# EAGLE design Trigger Delay Board (EAGLE 9.6.0)
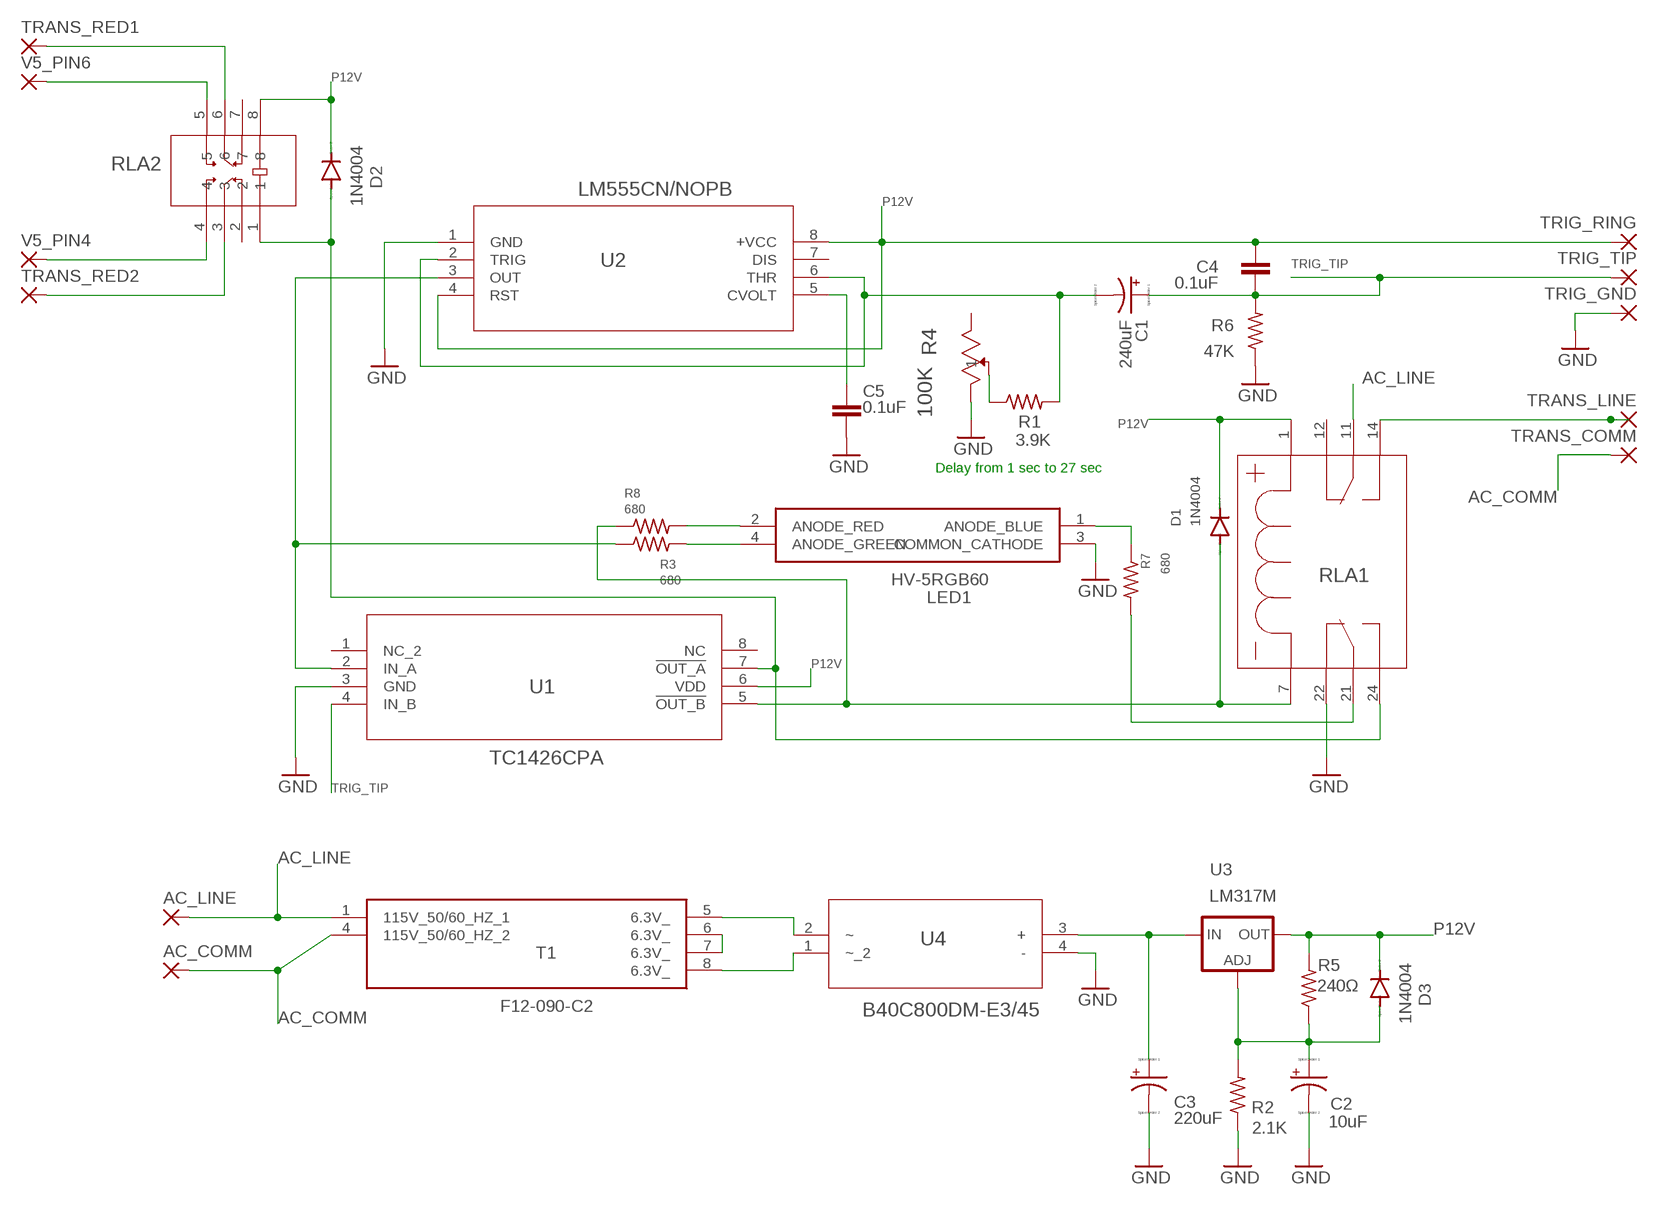
[diagram p0: schematic, sheet 1]

## Parts
AC_COMM  3,81/1,4  [3,81/1,4]
AC_LINE  3,81/1,4  [3,81/1,4]
C1  240uF  CPOL-USE1.8-4  [E1,8-4]
C2  10uF  CPOL-USE1.8-4  [E1,8-4]
C3  220uF  CPOL-USE1.8-4  [E1,8-4]
C4  0.1uF  C-EU025-024X044  [C025-024X044]
C5  0.1uF  C-EU025-024X044  [C025-024X044]
D1  1N4004  [DO41-10]
D2  1N4004  [DO41-10]
D3  1N4004  [DO41-10]
LED1  HV-5RGB60  [HV5RGB25]
R1  3.9K  R-US_0207/10  [0207/10]
R2  2.1K  R-US_0207/10  [0207/10]
R3  680  R-US_0207/10  [0207/10]
R4  100K  64WR100KLF  [RES3_64W]
R5  240Ω  R-US_0207/10  [0207/10]
R6  47K  R-US_0207/10  [0207/10]
R7  680  R-US_0207/10  [0207/10]
R8  680  R-US_0207/10  [0207/10]
RLA1  RTE24012  [RELAY-DPDT_5MM]
RLA2  G2RL-2_DC12  [RELAY_G2RL-2]
T1  F12-090-C2  [F12090C2]
TRANS_COMM  3,81/1,4  [3,81/1,4]
TRANS_LINE  3,81/1,4  [3,81/1,4]
TRANS_RED1  3,81/1,4  [3,81/1,4]
TRANS_RED2  3,81/1,4  [3,81/1,4]
TRIG_GND  3,81/1,4  [3,81/1,4]
TRIG_RING  3,81/1,4  [3,81/1,4]
TRIG_TIP  3,81/1,4  [3,81/1,4]
U1  TC1426CPA  [PDIP8_300MC]
U2  LM555CN/NOPB  [N08E]
U3  LM317MB  [TO220L1]
U4  B40C800DM-E3/45  [DIP4_DFM]
V5_PIN4  3,81/1,4  [3,81/1,4]
V5_PIN6  3,81/1,4  [3,81/1,4]

## Nets
AC_COMM [AC_PWR]: AC_COMM.1(P) T1.4(115V_50/60_HZ_2) TRANS_COMM.1(P)
AC_LINE [AC_PWR]: AC_LINE.1(P) RLA1.11 T1.1(115V_50/60_HZ_1)
GND: C2.- C3.- C5.2 LED1.3(COMMON_CATHODE) R2.1 R4.1 R6.1 RLA1.22 TRIG_GND.1(P) U1.3(GND) U2.1(GND) U4.4(-)
N$1: C2.+ D3.A R2.2 R5.1 U3.1(ADJ)
N$2: T1.6(6.3V_) T1.7(6.3V_)
N$3: T1.5(6.3V_) U4.2(~)
N$4: T1.8(6.3V_) U4.1(~_2)
N$5: D2.A RLA1.24 RLA2.1 U1.7(!OUT_A)
N$6: R3.1 U1.2(IN_A) U2.3(OUT)
N$8: LED1.2(ANODE_RED) R8.2
N$9: R1.1 R4.2
N$10: C5.1 U2.5(CVOLT)
N$11: D1.A R8.1 RLA1.7 U1.5(!OUT_B)
N$12: R7.2 RLA1.21
N$13: C1.- R1.2 U2.2(TRIG) U2.6(THR)
N$17: LED1.1(ANODE_BLUE) R7.1
N$18: LED1.4(ANODE_GREEN) R3.2
N$20: C3.+ U3.3(IN) U4.3(+)
P12V: C4.1 D1.C D2.C D3.C R5.2 RLA1.1 RLA2.8 TRIG_RING.1(P) U1.6(VDD) U2.4(RST) U2.8(+VCC) U3.2(OUT)
TRANS_LINE [AC_PWR]: RLA1.14 TRANS_LINE.1(P)
TRANS_RED1 [PLATE]: RLA2.6 TRANS_RED1.1(P)
TRANS_RED2 [PLATE]: RLA2.3 TRANS_RED2.1(P)
TRIG_TIP: C1.+ C4.2 R6.2 TRIG_TIP.1(P) U1.4(IN_B)
V5_PIN4 [PLATE]: RLA2.4 V5_PIN4.1(P)
V5_PIN6 [PLATE]: RLA2.5 V5_PIN6.1(P)
Unconnected: R4.3 RLA1.12 RLA2.2 RLA2.7 U1.1(NC_2) U1.8(NC) U2.7(DIS)

## Notes on the sheet
- Delay from 1 sec to 27 sec

## Library data of the parts
AC_COMM AC_LINE TRANS_COMM TRANS_LINE TRANS_RED1 TRANS_RED2 TRIG_GND TRIG_RING TRIG_TIP V5_PIN4 V5_PIN6 = wirepad:3,81/1,4: THROUGH-HOLE PAD
C1-C3 = resistor:CPOL-US: POLARIZED CAPACITOR, American symbol
C4 C5 = rcl:C-EU: CAPACITOR, European symbol; SPICEPREFIX: C
D1-D3 = diode:1N4004: DIODE general purpose rectifier, 1 A
LED1 = HV-5RGB60:HV-5RGB60: Standard LEDs - Through Hole RGB LED Source: Datasheet <http://www.inolux-corp.com/datasheet/Inolux Lamp/TH Lamp/HV-5RGBXX 5mm Full-Color Series.pdf>; DESCRIPTION: Standard LEDs - Through Hole RGB LED; HEIGHT: 8.9mm; MANUFACTURER_NAME: Inolux; MANUFACTURER_PART_NUMBER: HV-5RGB60; MOUSER_PART_NUMBER: 743-HV-5RGB60; MOUSER_PRICE-STOCK: https://www.mouser.com/Search/Refine.aspx?Keyword=743-HV-5RGB60
R1-R3 R5-R8 = resistor:R-US_: RESISTOR, American symbol
R4 = 64WR100KLF:64WR100KLF; COPYRIGHT: Copyright (C) 2016 Accelerated Designs. All rights reserved; MANUFACTURER_PART_NUMBER: 64WR100KLF; VENDOR: TT Electronics
RLA1 = RTE24012:RTE24012; BUILT_BY: EMA_UL_Team; COPYRIGHT: Copyright (C) 2016 Accelerated Designs. All rights reserved; MANUFACTURER_PART_NUMBER: RTE24012; VENDOR: TE Connectivity
RLA2 = G2RL-2_DC12:G2RL-2_DC12; BUILT_BY: EMA_Justin; COPYRIGHT: Copyright (C) 2018 Accelerated Designs. All rights reserved; MANUFACTURER_PART_NUMBER: G2RL-2 DC12; VENDOR: Omron
T1 = SamacSys_Parts:F12-090-C2: Power Transformers PC/1.1VA/6P/Class2/3 12.6VCT@0.09A Series Source: Datasheet <http://catalog.triadmagnetics.com/Asset/F12-090-C2.pdf>; ALLIED_NUMBER: 70314095; ALLIED_PRICE-STOCK: https://www.alliedelec.com/triadmagnetics-f12-090-c2/70314095/; DESCRIPTION: Power Transformers PC/1.1VA/6P/Class2/3 12.6VCT@0.09A Series; HEIGHT: 28.702mm; MANUFACTURER_NAME: Triad Magnetics; MANUFACTURER_PART_NUMBER: F12-090-C2; MOUSER_PART_NUMBER: 553-F12-090-C2; MOUSER_PRICE-STOCK: https://www.mouser.com/Search/Refine.aspx?Keyword=553-F12-090-C2
U1 = TC1426CPA:TC1426CPA: 1.2A Dual High-Speed MOSFET Drivers; BUILT_BY: EMA_UL_Team; MANUFACTURER_PART_NUMBER: TC1426CPA; VENDOR: Microchip
U2 = LM555CN:LM555CN/NOPB; MANUFACTURER_PART_NUMBER: LM555CN/NOPB; VENDOR: National
U3 = v-reg:LM317?*: 500 mA Adjustable Output Positive Voltage Regulator Source: http://www.onsemi.co.jp .. LM317M-D.PDF; PARTNUMBER: LM317M
U4 = B40C800DM-E3-45:B40C800DM-E3/45; BUILT_BY: EMA_UL_Team; MANUFACTURER_PART_NUMBER: B40C800DM-E3/45; SPICEPREFIX: E; VENDOR: Vishay

## Net classes
1 AC_PWR: width 0.813 mm, clearance 1.448 mm
2 PLATE: width 0.127 mm, clearance 2.032 mm

## Board
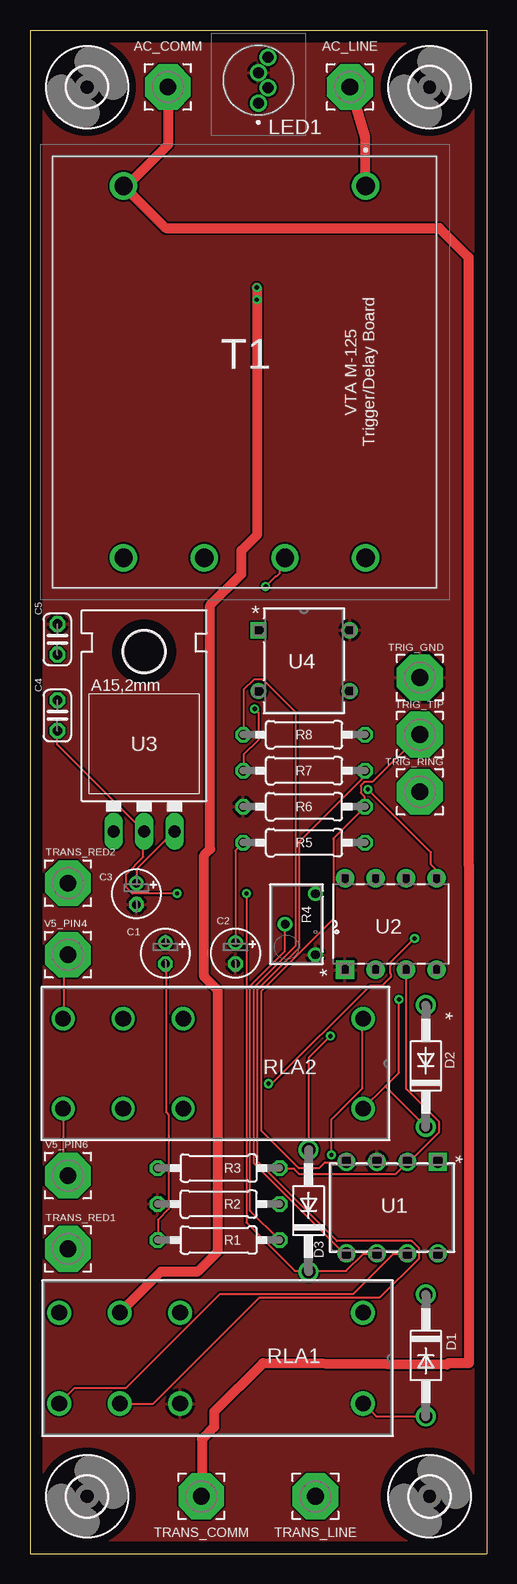
[diagram p1: board, top side]
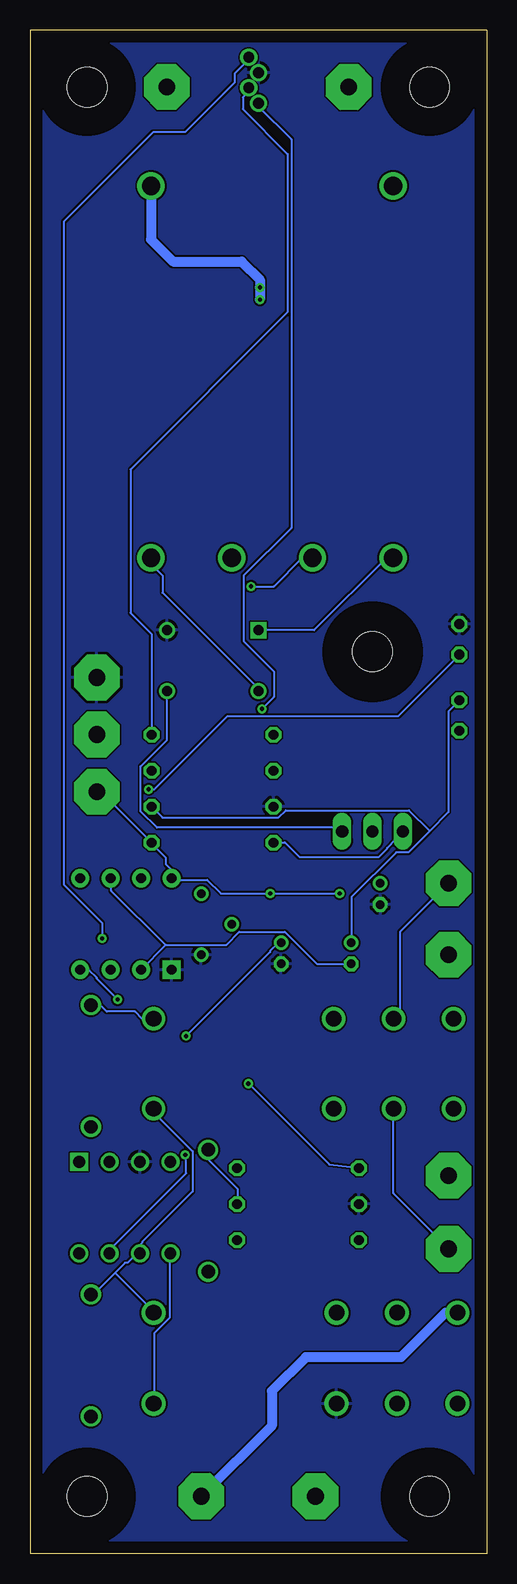
[diagram p2: board, bottom side, seen from below]

Size 38.1 x 127 mm. Coordinates in mm from the lower left corner, seen from the top.
Outline: 0,0 38.1,0 38.1,127 0,127 0,0
Copper layers (1*16): Top 0.035mm / dielectric 1.5mm / Bottom 0.035mm
Design rules "default": minimum track width 6mil, minimum drill 0.35mm, track to track 6mil, track to pad 6mil, pad to pad 6mil, via to via 6mil, smd to smd 6mil, copper to edge 40mil, drill to drill 6mil, minimum pad ring 10mil, minimum via ring 8mil, stop-mask expansion 4mil, vias tented up to drill 0mil, thermal gap 10mil

### Footprints (pad centres in the part's own frame; a part is rotated, then mirrored left to right if it is on the bottom)
3,81/1,4 = drill 1.397 pad 3.81 octagon: 1 0,0
E1,8-4 = drill 0.711 pad 1.168: + -0.889,0 | drill 0.711 pad 1.168 octagon: - 0.889,0
C025-024X044 = drill 0.813 octagon: 1 -1.27,0; 2 1.27,0
DO41-10 = drill 1.118: A 5.08,0; C -5.08,0
HV5RGB25 = drill 0.91 pad 1.35: 1 0,0; 2 1.27,-0.8; 3 2.54,0; 4 3.81,-0.8
0207/10 = drill 0.813 octagon: 1 -5.08,0; 2 5.08,0
RES3_64W = drill 0.711 pad 1.219: 1 -5.08,-3.175; 2 -2.54,-0.635; 3 0,-3.175
RELAY-DPDT_5MM = drill 1.295 pad 2.007: 1 -7.569,24.282; 7 0,24.282; 11 -7.569,3.988; 12 -7.569,9.017; 14 -7.569,-1.067; 21 0,3.988; 22 0,9.017; 24 0,-1.067
RELAY_G2RL-2 = drill 1.295 pad 1.803: 1 -7.493,24.613; 2 -7.493,9.601; 3 -7.493,4.597; 4 -7.493,-0.406; 5 0,-0.406; 6 0,4.597; 7 0,9.601; 8 0,24.613
F12090C2 = drill 1.524 pad 2.286: 1 0,0; 4 20.193,0; 5 0,31; 6 6.731,31; 7 13.462,31; 8 20.193,31
PDIP8_300MC = drill 0.991 pad 1.499 square: 1 -7.62,7.62 | drill 0.991 pad 1.499: 2 -7.62,5.08; 3 -7.62,2.54; 4 -7.62,0; 5 0,0; 6 0,2.54; 7 0,5.08; 8 0,7.62
N08E = drill 0.813 pad 1.524 square: 1 -7.62,7.62 | drill 0.813 pad 1.524: 2 -7.62,5.08; 3 -7.62,2.54; 4 -7.62,0; 5 0,0; 6 0,2.54; 7 0,5.08; 8 0,7.62
TO220L1 = drill 1.016 long: 1 -2.54,-3.81; 2 0,-3.81; 3 2.54,-3.81 | hole 3.302: 0,11.176
DIP4_DFM = drill 0.838 pad 1.346 square: 1 -7.62,5.08 | drill 0.838 pad 1.346: 2 -7.62,0; 3 0,0; 4 0,5.08
3,3 = hole 3.3: 0,0

### Placement (x,y rotation side)
AC_COMM  11.51,122.25 0 top
AC_LINE  26.69,122.25 0 top
C1  11.3,50.04 270 top
C2  17.14,50.04 270 top
C3  8.89,54.99 270 top
C4  2.29,69.85 90 top
C5  2.29,76.2 90 top
D1  33.02,16.51 270 top
D2  33.02,40.64 90 top
D3  23.24,28.57 90 top
LED1  19.05,120.9 90 top
R1  15.74,26.13 180 top
R2  15.74,29.13 0 top
R3  15.74,32.13 180 top
R4  20.64,54.99 90 top
R5  22.87,59.25 0 top
R6  22.87,62.25 0 top
R7  22.87,65.25 0 top
R8  22.87,68.25 0 top
RLA1  3.51,12.5 270 top
RLA2  3.17,37.08 270 top
T1  28,114 180 top
TRANS_COMM  14.29,4.76 0 top
TRANS_LINE  23.81,4.76 0 top
TRANS_RED1  3.17,25.4 0 top
TRANS_RED2  3.17,55.88 0 top
TRIG_GND  32.52,73.03 0 top
TRIG_RING  32.52,63.5 0 top
TRIG_TIP  32.52,68.26 0 top
U1  26.39,25.02 270 top
U2  33.91,56.29 90 top
U3  9.53,64.01 0 top
U4  26.67,71.88 0 top
U$1  [3,3]  4.76,4.76 0 top
U$2  [3,3]  33.34,4.76 0 top
U$7  [3,3]  4.76,122.24 0 top
U$8  [3,3]  33.34,122.24 0 top
V5_PIN4  3.17,49.91 0 top
V5_PIN6  3.17,31.5 0 top

### Tracks (layer width: path | path; a pad name or v marks a point on that pad's centre or on a via)
AC_COMM
  Top 0.813: T1.4 7.94,113.86 | 7.94,113.86 11.32,110.49 34.16,110.49 36.58,108.08 36.58,57.42 36.62,57.38 36.62,15.88 34.92,15.88 34.8,15.75 19.43,15.88 15.37,11.82 15.37,10.55 14.35,9.53 14.35,4.8 14.33,4.8 TRANS_COMM.1 | AC_COMM.1 11.51,117.43 7.94,113.86
AC_LINE  (via drill 0.35)
  Top 0.813: AC_LINE.1 27.94,118.06 27.94,114.07 27.96,114.07 T1.1 | v18.92,105.54 18.92,84.89 17.64,83.61 17.64,81.64 15.04,79.05 15.04,58.73 14.54,58.22 14.54,48.09 15.63,47 15.63,25.15 13.96,23.48 10.9,23.48 RLA1.11
  Bottom 0.813: T1.1 28,109.53 26.16,107.7 20.45,107.7 18.92,106.17 v18.92,105.54 v18.92,104.52
GND
  pour Top: -2,128 -2,-2 39,-2 39,128
  pour Bottom: -2,128 -2,-2 39,-2 39,129 -1,129
N$1  (via drill 0.35)
  Top 0.152: C2.+ 17.14,58.6 17.75,59.21 R5.1 | D3.A 23.24,41.3 v25.07,43.13
  Bottom 0.152: D3.A 23.24,32.84 20.8,30.4 20.8,29.18 R2.2 | U3.1 7.01,60.2 7.62,59.59 7.62,59.51 8.31,58.83 8.31,58.75 8.99,58.06 15.62,58.06 16.84,59.28 17.75,59.28 R5.1 | v25.07,43.13 18.06,50.14 18.06,50.22 17.37,50.9 17.14,50.9 C2.+
N$2  (via drill 0.35)
  Top 0.152: v19.66,80.62 20.5,81.46 20.57,81.46 20.8,81.69 20.8,82.53 21.26,82.98 T1.6
  Bottom 0.152: v19.66,80.62 17.75,80.62 15.39,82.98 14.55,82.98 T1.7
N$3
  Bottom 0.152: U4.2 19.05,72.08 27.05,80.09 27.05,81.53 27.96,82.45 27.96,82.98 T1.5
N$4
  Bottom 0.152: U4.1 14.4,76.96 8.38,82.98 7.85,82.98 T1.8
N$5  (via drill 0.35)
  Top 0.152: RLA1.24 3.73,13.79 8,13.79 15.85,21.64 26.98,21.64 30.33,24.99 31.47,24.99 U1.7 | v25.15,33.22 25.15,36.2 27.74,38.79 27.74,44.58 RLA2.1
  Bottom 0.152: D2.A 32.23,45.72 31.7,45.19 29.34,45.19 28.73,44.58 RLA2.1 | v25.15,33.22 25.15,33.07 25.07,32.99 25.07,31.7 31.47,25.3 U1.7
N$6
  Top 0.152: R3.1 20.88,32.08 22.02,32.08 22.48,31.62 30.48,31.62 31.47,32.61 U1.2 31.47,32.69 31.7,32.69 34.14,35.13 34.14,35.97 31.39,38.71 31.39,48.62 U2.3
N$8
  Bottom 0.152: R8.2 27.96,68.28 27.96,76.66 29.72,78.41 29.72,90.37 16.61,103.48 16.61,116.66 20.34,120.4 20.34,121.39 19.89,121.84 19.89,122.15 LED1.2
N$9
  Top 0.152: R4.2 21.26,52.43 21.26,50.22 18.36,47.32 18.36,28.57 20.8,26.14 R1.1
N$10  (via drill 0.35)
  Top 0.152: v28.19,63.7 33.45,58.45 33.45,57.45 33.91,57 U2.5
  Bottom 0.152: v28.19,63.7 27.74,63.7 21.64,69.8 7.39,69.8 2.29,74.91 C5.1
N$11
  Top 0.152: D1.A 28.88,11.43 27.81,12.5 RLA1.7 | R8.1 17.83,68.28 17.83,72.01 18.67,72.85 19.43,72.85 22.17,70.1 22.17,50.67 18.67,47.17 18.67,32.54 26.14,25.07 26.36,25.07 U1.5
  Bottom 0.152: RLA1.7 27.74,12.5 27.74,18.36 26.44,19.66 26.44,24.99 U1.5
N$12
  Top 0.152: RLA1.21 10.29,12.5 19.13,21.34 29.18,21.34 32.46,24.61 32.46,25.45 31.85,26.06 25.6,26.06 18.97,32.69 18.97,47.02 22.48,50.52 22.48,59.36 27.89,64.77 27.89,65.23 R7.2
N$13
  Top 0.152: R1.2 10.67,27.81 11.58,28.73 11.58,36.58 11.35,36.8 11.35,49.15 C1.-
  Bottom 0.152: C1.- 14.17,49.15 16.84,51.82 20.65,51.82 21.72,50.75 26.75,50.75 26.78,50.71 | U2.2 26.78,50.71 | 26.78,50.71 31.32,55.24 31.32,56.24 U2.6
N$17  (via drill 0.35)
  Top 0.152: v18.75,70.41 19.05,70.1 19.05,67.82 17.83,66.6 17.83,65.3 R7.1
  Bottom 0.152: v18.75,70.41 17.75,71.4 17.75,73.53 20.27,76.05 20.27,81.53 16.31,85.5 16.31,117.88 19.05,120.62 LED1.1
N$18  (via drill 0.35)
  Top 0.152: v19.89,39.17 20.19,39.17 28.35,47.32 29.34,47.32 30.1,48.08 30.1,48.31 30.02,48.39 30.02,49 30.1,49.07 30.1,49.3 v32.08,51.28
  Bottom 0.152: v19.89,39.17 13.14,32.42 R3.2 | v32.08,51.28 32.08,52.58 35.28,55.78 35.28,111.02 27.81,118.49 25.15,118.49 21.03,122.61 21.03,123.37 19.89,124.51 19.89,124.66 LED1.4
N$20
  Top 0.152: C3.+ 8.91,55.93 8.91,57.07 12.04,60.2 U3.3
  Bottom 0.152: U4.3 26.67,67.82 28.88,65.61 28.88,61.87 27.51,60.5 12.42,60.5 12.12,60.2 U3.3
P12V  (via drill 0.35)
  Top 0.152: 23.24,23.55 26.36,23.55 27.81,24.99 28.88,24.99 U1.6 | v30.79,46.18 30.79,40.08 29.64,38.94 | RLA2.8 29.64,38.94 | 29.64,38.94 D2.C | C4.1 2.29,67.44 U3.2 9.45,60.2 9.45,58.06 8,56.62 8,55.55 8.53,55.02 v12.27,55.02 | 23.24,23.55 22.1,23.55 18.06,27.58 v18.06,55.02 | 23.24,23.55 D3.C
  Bottom 0.152: 31.01,23.39 30.18,24.23 29.95,24.23 29.18,24.99 28.96,24.99 U1.6 28.88,25.07 28.88,25.76 28.73,25.91 28.73,25.98 24.54,30.18 24.54,33.53 27.74,36.73 27.74,37.03 RLA2.8 | 31.01,23.39 32.77,21.64 32.99,21.64 D1.C | 31.01,23.39 28.42,20.8 28.42,20.73 27.81,20.12 RLA1.1 | v30.79,46.18 32.54,47.93 32.54,48.01 33.15,48.62 33.91,48.62 U2.4 | TRIG_RING.1 32.46,63.48 32.16,63.48 27.96,59.28 R5.2 27.89,59.21 27.58,58.9 27.58,58.83 26.75,57.99 26.75,57.45 26.29,57 U2.8 26.29,56.24 26.21,56.16 23.32,56.16 22.17,55.02 v18.06,55.02 v12.27,55.02
TRANS_LINE
  Bottom 0.813: TRANS_LINE.1 17.91,10.66 17.91,13.56 15.1,16.37 7.14,16.37 3.45,20.07 RLA1.14
TRANS_RED1
  Bottom 0.152: RLA2.6 7.77,30.02 3.2,25.45 TRANS_RED1.1
TRANS_RED2
  Bottom 0.152: TRANS_RED2.1 7.24,51.82 7.24,45.11 RLA2.3
TRIG_TIP
  Top 0.152: TRIG_TIP.1 32.46,68.2 28.57,64.31 27.89,64.31 27.58,64.01 27.58,63.4 27.89,63.09 27.89,62.26 R6.2 27.89,62.18 25.3,59.59 25.3,52.88 19.28,46.86 19.28,35.28 22.4,32.16 24.16,32.16 24.61,32.61 26.36,32.61 U1.4
  Bottom 0.152: 4.76,60.24 3.2,61.8 3.2,70.18 2.29,71.09 C4.2 | 4.76,60.24 6.55,58.45 7.54,58.45 11.28,54.71 11.28,50.98 C1.+ | 4.76,60.24 6.48,61.95 16.76,61.95 17.37,61.34 27.05,61.34 27.89,62.18 R6.2
V5_PIN4
  Top 0.152: RLA2.4 2.82,44.58 2.82,49.61 3.12,49.91 V5_PIN4.1
V5_PIN6
  Top 0.152: V5_PIN6.1 2.82,31.85 2.82,37.03 RLA2.5

### Text on the board
tNames: VTA M-125 / Trigger/Delay Board
top_silk: 1